# EAGLE design controller (EAGLE 9.6.2)
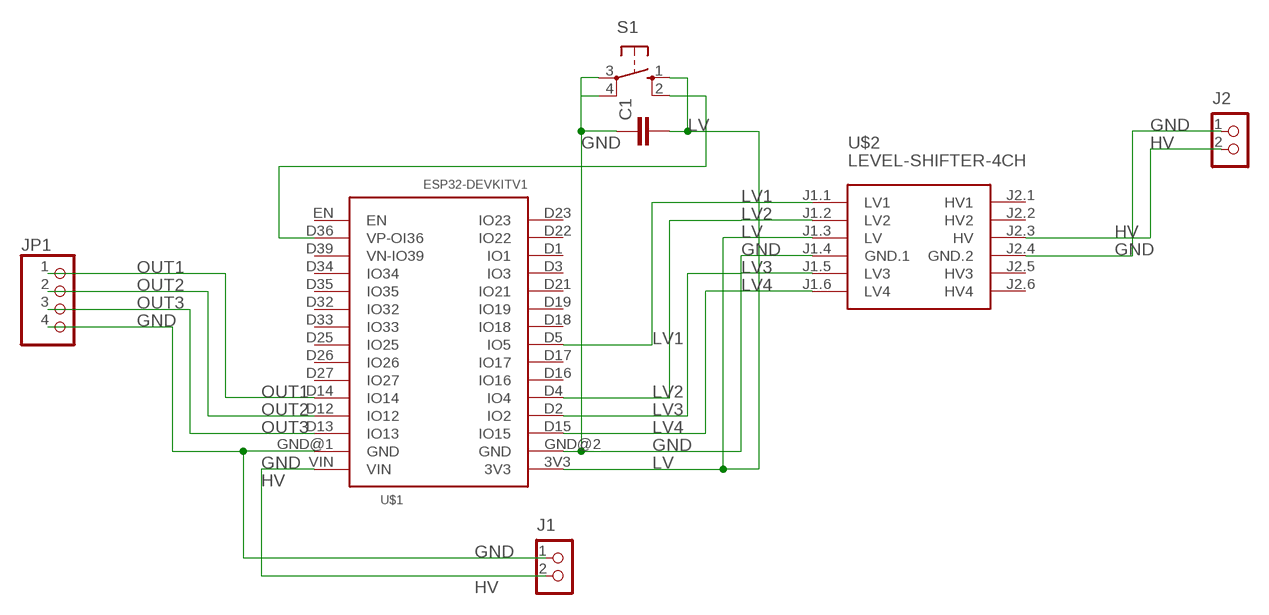
[diagram p0: schematic, sheet 1]

## Parts
C1  C-EU025-025X050  [C025-025X050]
J1  CON_TERMINAL_BLOCK_02-5MM  [TERMINAL_BLOCK_2P_5]
J2  CON_TERMINAL_BLOCK_02-5MM  [TERMINAL_BLOCK_2P_5]
JP1  PINHD-1X4  [1X04]
S1  10-XX  [B3F-10XX]
U$1  ESP32DEVKITV1  [ESP32-DEVKITV1]
U$2  LEVEL-SHIFTER-4CH  [LEVEL-SHIFTER-4CH]

## Nets
GND: C1.1 J1.1 J2.1 JP1.4 S1.3(P) S1.4(P1) U$1.GND@1(GND) U$1.GND@2(GND) U$2.J1.4(GND.1) U$2.J2.4(GND.2)
HV: J1.2 J2.2 U$1.VIN U$2.J2.3(HV)
LV: C1.2 S1.1(S) S1.2(S1) U$1.3V3 U$1.D36(VP-OI36) U$2.J1.3(LV)
LV1: U$1.D5(IO5) U$2.J1.1(LV1)
LV2: U$1.D4(IO4) U$2.J1.2(LV2)
LV3: U$1.D2(IO2) U$2.J1.5(LV3)
LV4: U$1.D15(IO15) U$2.J1.6(LV4)
OUT1: JP1.1 U$1.D14(IO14)
OUT2: JP1.2 U$1.D12(IO12)
OUT3: JP1.3 U$1.D13(IO13)
Unconnected: U$1.D1(IO1) U$1.D3(IO3) U$1.D16(IO16) U$1.D17(IO17) U$1.D18(IO18) U$1.D19(IO19) U$1.D21(IO21) U$1.D22(IO22) U$1.D23(IO23) U$1.D25(IO25) U$1.D26(IO26) U$1.D27(IO27) U$1.D32(IO32) U$1.D33(IO33) U$1.D34(IO34) U$1.D35(IO35) U$1.D39(VN-IO39) U$1.EN U$2.J2.1(HV1) U$2.J2.2(HV2) U$2.J2.5(HV3) U$2.J2.6(HV4)

## Library data of the parts
C1 = rcl:C-EU: CAPACITOR, European symbol; SPICEPREFIX: C
J1 J2 = tblok:CON_TERMINAL_BLOCK_02: 2 poles wire to board terminal block
JP1 = pinhead:PINHD-1X4: PIN HEADER
S1 = switch-omron:10-XX: OMRON SWITCH; MPN: B3F-1000; OC_FARNELL: 176432; OC_NEWARK: 36M3542
U$1 = esp32-devkitv1:ESP32DEVKITV1
U$2 = diy-model:LEVEL-SHIFTER-4CH: 4-Channel Bi-Directional Logic Level Converter based on BSS128 transistors Click here to find device on ebay.com <http://www.ebay.com/sch/i2c+logic+converter+module>

## Board
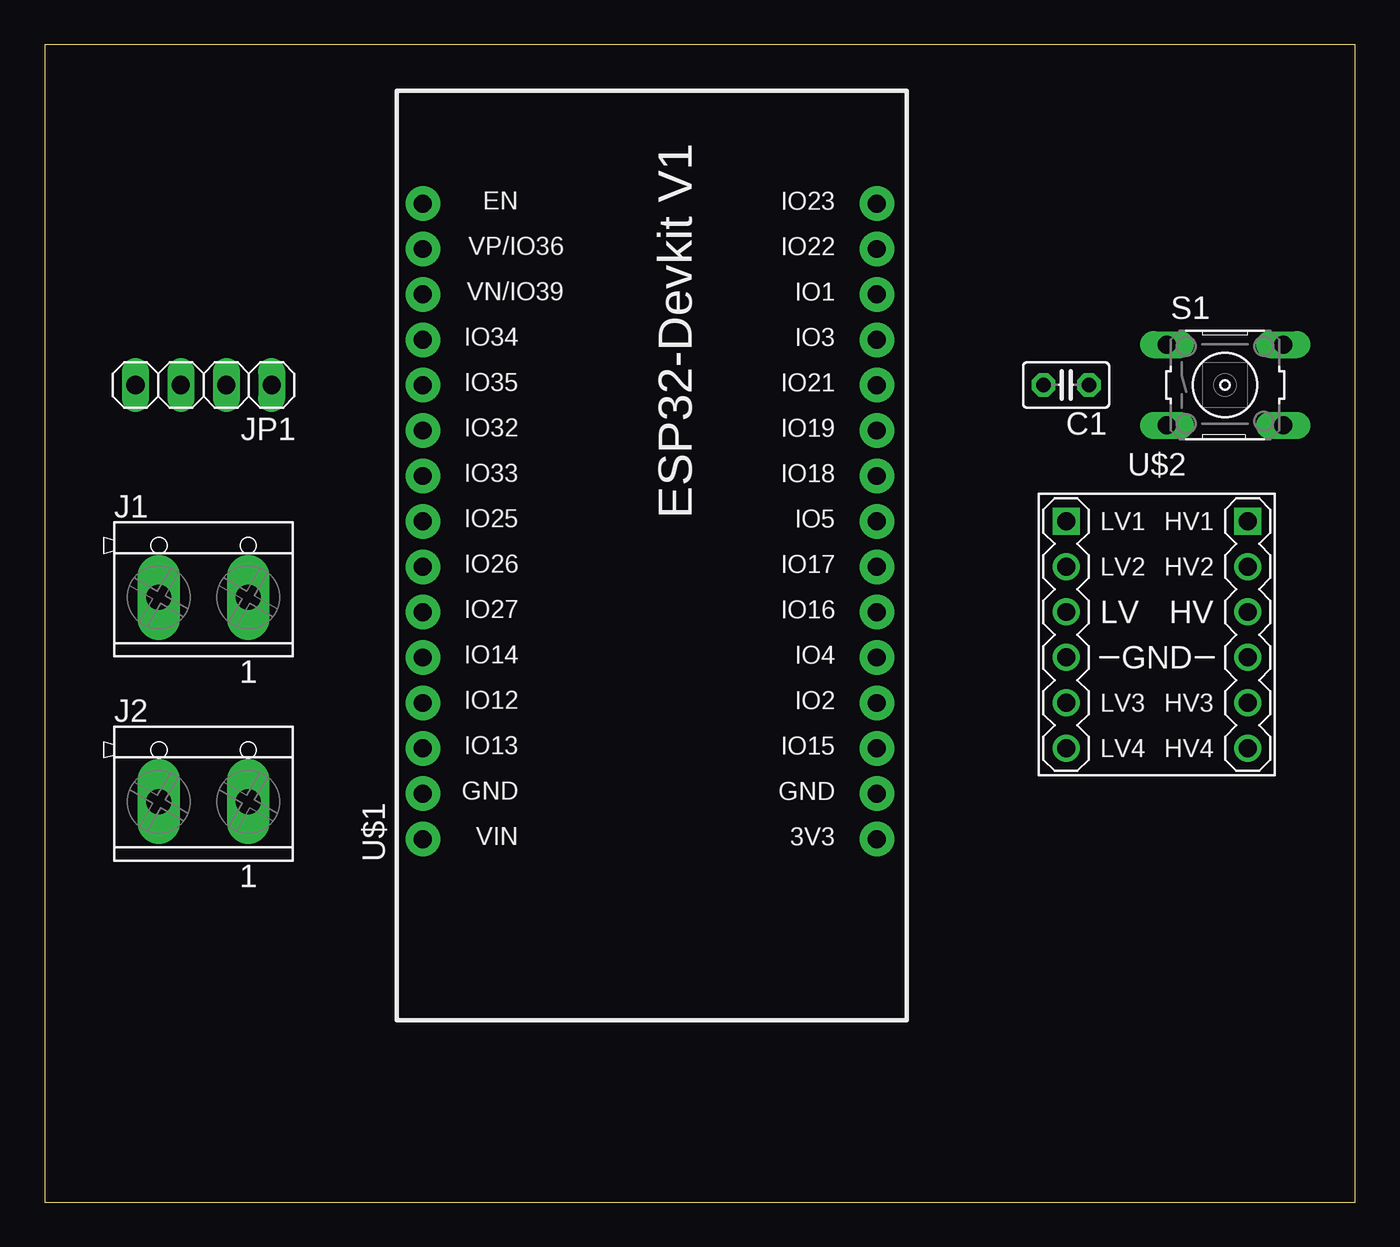
[diagram p1: board, top side]
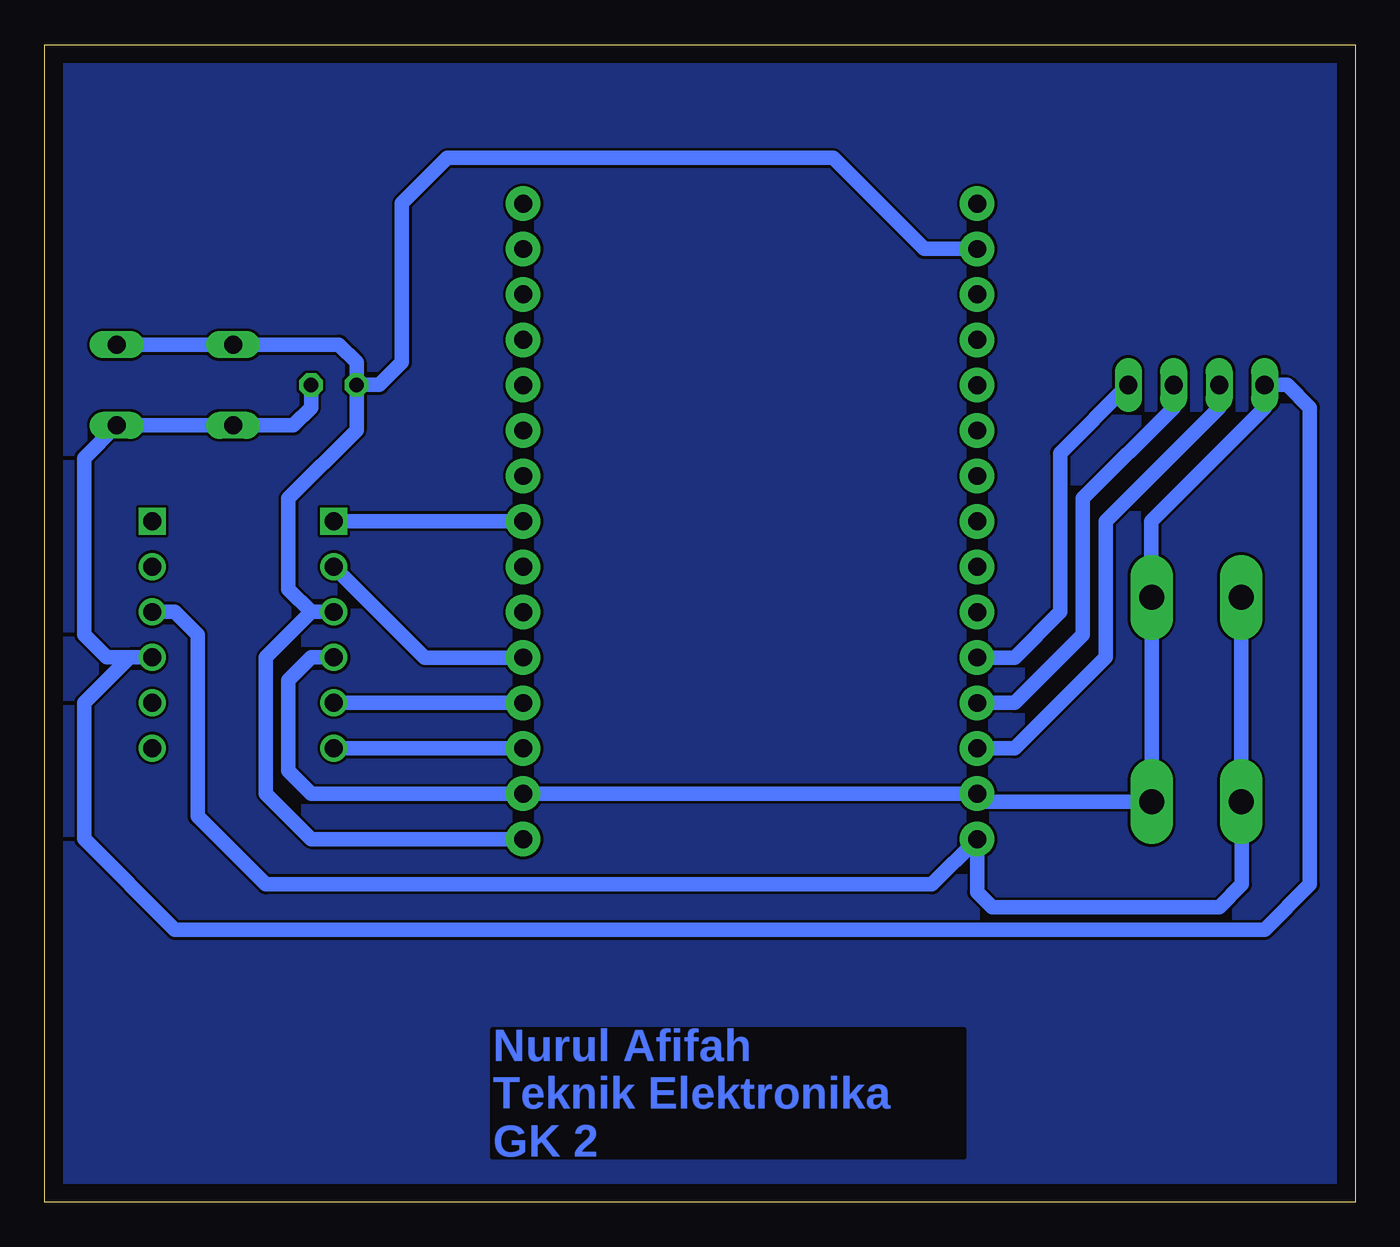
[diagram p2: board, bottom side, seen from below]

Size 73.33 x 64.76 mm. Coordinates in mm from the lower left corner, seen from the top.
Outline: 0,0 73.33,0 73.33,64.76 0,64.76 0,0
Copper layers (1*16): Top 0.035mm / dielectric 1.5mm / Bottom 0.035mm
Design rules "default": minimum track width 6mil, minimum drill 0.35mm, track to track 6mil, track to pad 6mil, pad to pad 6mil, via to via 6mil, smd to smd 6mil, copper to edge 40mil, drill to drill 6mil, minimum pad ring 10mil, minimum via ring 8mil, stop-mask expansion 4mil, vias tented up to drill 0mil, thermal gap 10mil

### Footprints (pad centres in the part's own frame; a part is rotated, then mirrored left to right if it is on the bottom)
C025-025X050 = drill 0.813 octagon: 1 -1.27,0; 2 1.27,0
TERMINAL_BLOCK_2P_5 = drill 1.4 pad 2.38 long: 1 2.5,-0.45; 2 -2.5,-0.45
1X04 = drill 1.016 long: 1 -3.81,0; 2 -1.27,0; 3 1.27,0; 4 3.81,0
B3F-10XX = drill 1.016 long: 1 -3.251,2.261; 2 3.251,2.261; 3 -3.251,-2.261; 4 3.251,-2.261
ESP32-DEVKITV1 = drill 1 pad 1.93: 3V3 -16.52,-12.27; D1 13.96,-12.27; D2 -8.9,-12.27; D3 11.42,-12.27; D4 -6.36,-12.27; D5 1.26,-12.27; D12 -8.9,13.135; D13 -11.44,13.135; D14 -6.36,13.135; D15 -11.44,-12.27; D16 -3.82,-12.27; D17 -1.28,-12.27; D18 3.8,-12.27; D19 6.34,-12.27; D21 8.88,-12.27; D22 16.5,-12.27; D23 19.04,-12.27; D25 1.26,13.135; D26 -1.28,13.135; D27 -3.82,13.135; D32 6.34,13.135; D33 3.8,13.135; D34 11.42,13.135; D35 8.88,13.135; D36 16.5,13.135; D39 13.96,13.135; EN 19.04,13.135; GND@1 -13.98,13.135; GND@2 -13.98,-12.27; VIN -16.52,13.135
LEVEL-SHIFTER-4CH = drill 1 square: J1.1 -5.08,6.35; J2.1 5.08,6.35 | drill 1: J1.2 -5.08,3.81; J1.3 -5.08,1.27; J1.4 -5.08,-1.27; J1.5 -5.08,-3.81; J1.6 -5.08,-6.35; J2.2 5.08,3.81; J2.3 5.08,1.27; J2.4 5.08,-1.27; J2.5 5.08,-3.81; J2.6 5.08,-6.35

### Placement (x,y rotation side)
C1  57.15,45.72 180 top
J1  8.89,34.29 0 top
J2  8.89,22.86 0 top
JP1  8.89,45.72 180 top
S1  66.04,45.72 0 top
U$1  34.29,36.83 90 top
U$2  62.23,31.75 0 top

### Tracks (layer width: path | path; a pad name or v marks a point on that pad's centre or on a via)
BOARD
  pour Bottom: 0,64.77 73.66,64.77 73.66,0 0,0
GND
  Bottom 0.813: C1.1 58.42,44.45 59.41,43.46 S1.3 S1.4 71.12,41.63 71.12,31.75 69.85,30.48 U$2.J2.4 68.58,30.48 71.12,27.94 71.12,20.32 66.04,15.24 5.08,15.24 2.54,17.78 2.54,44.45 3.81,45.72 JP1.4 5.08,44.45 11.43,38.1 11.43,33.88 J1.1 11.39,22.9 11.43,22.86 11.43,22.45 J2.1 20.71,22.41 U$1.GND@1 U$1.GND@2 58.42,22.86 59.69,24.13 59.69,29.21 58.42,30.48 U$2.J1.4
HV
  Bottom 0.813: J1.2 J2.2 6.35,22.37 6.35,17.78 7.62,16.51 20.32,16.51 21.16,17.34 U$1.VIN 23.69,17.78 60.96,17.78 64.77,21.59 64.77,31.75 66.04,33.02 U$2.J2.3
LV
  Bottom 0.813: S1.2 S1.1 56.87,47.98 55.88,46.99 C1.2 | U$1.D36 24.12,53.33 29.21,58.42 50.8,58.42 53.34,55.88 53.34,46.99 54.61,45.72 C1.2 | 58.42,33.02 59.69,34.29 59.69,39.37 55.88,43.18 C1.2 | U$2.J1.3 58.42,33.02 | 58.42,33.02 60.96,30.48 60.96,22.86 58.41,20.31 U$1.3V3
LV1
  Bottom 0.813: U$1.D5 U$2.J1.1
LV2
  Bottom 0.813: U$1.D4 52.06,30.47 U$2.J1.2
LV3
  Bottom 0.813: U$2.J1.5 U$1.D2
LV4
  Bottom 0.813: U$1.D15 U$2.J1.6
OUT1
  Bottom 0.813: U$1.D14 19.06,30.47 16.51,33.02 16.51,41.91 JP1.1
OUT2
  Bottom 0.813: JP1.2 10.16,44.45 15.24,39.37 15.24,31.75 19.06,27.93 U$1.D12
OUT3
  Bottom 0.813: JP1.3 7.62,44.45 13.97,38.1 13.97,30.48 19.06,25.39 U$1.D13

### Text on the board
Bottom: Nurul Afifah / Teknik Elektronika / GK 2